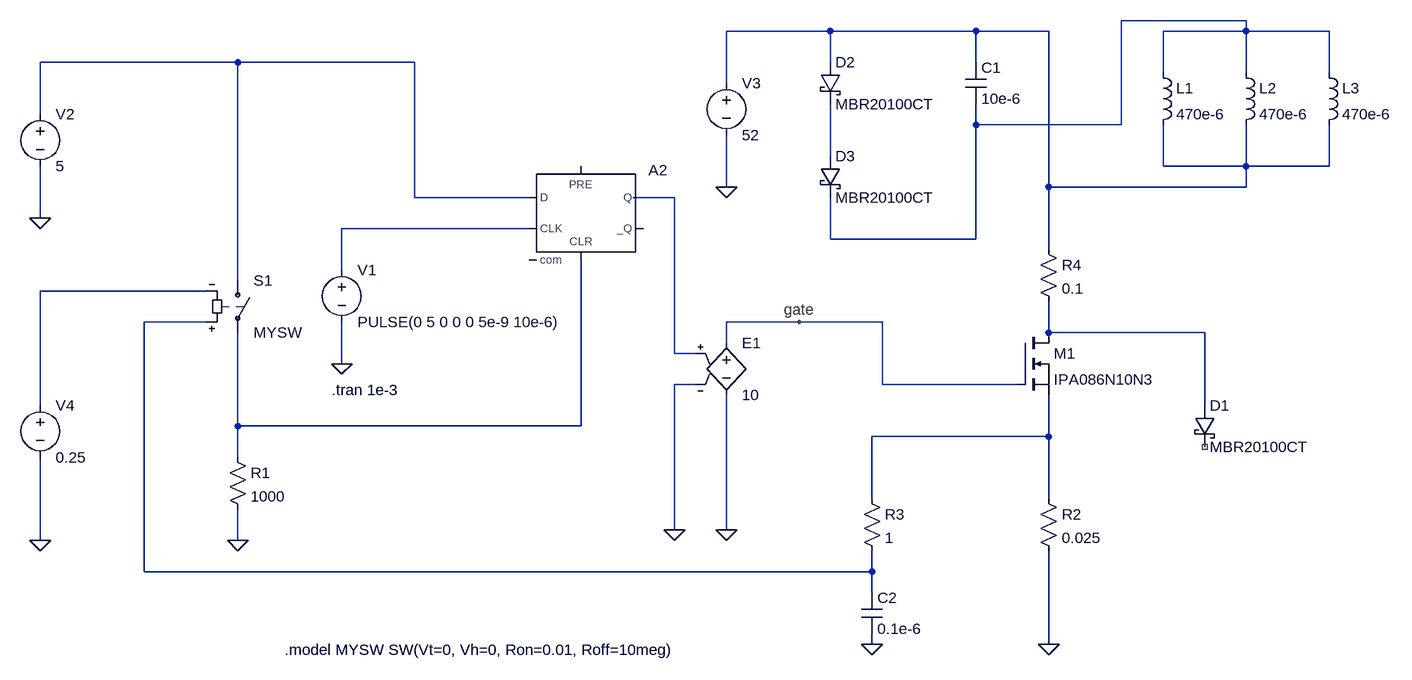
[diagram p0: schematic LT spice model hv9910c v3.asc]
LT spice model hv9910c v3.asc, the LTspice schematic file:
Version 4
SHEET 1 1160 696
WIRE 880 -288 688 -288
WIRE 240 -272 80 -272
WIRE 464 -272 240 -272
WIRE 576 -272 464 -272
WIRE 880 -272 880 -288
WIRE 880 -272 752 -272
WIRE 1008 -272 880 -272
WIRE -672 -224 -976 -224
WIRE -400 -224 -672 -224
WIRE 240 -224 240 -272
WIRE 464 -224 464 -272
WIRE 752 -208 752 -272
WIRE 880 -208 880 -272
WIRE 1008 -208 1008 -272
WIRE 80 -192 80 -272
WIRE -976 -144 -976 -224
WIRE 464 -128 464 -160
WIRE 688 -128 688 -288
WIRE 688 -128 464 -128
WIRE 240 -80 240 -160
WIRE 752 -64 752 -128
WIRE 880 -64 880 -128
WIRE 880 -64 752 -64
WIRE 1008 -64 1008 -128
WIRE 1008 -64 880 -64
WIRE 80 -32 80 -112
WIRE 576 -32 576 -272
WIRE 880 -32 880 -64
WIRE 880 -32 576 -32
WIRE -400 -16 -400 -224
WIRE -224 -16 -400 -16
WIRE 0 -16 -64 -16
WIRE -976 16 -976 -64
WIRE -224 32 -512 32
WIRE 240 48 240 -16
WIRE 464 48 464 -128
WIRE 464 48 240 48
WIRE 576 64 576 -32
WIRE -512 96 -512 32
WIRE -672 112 -672 -224
WIRE -720 128 -976 128
WIRE -720 176 -816 176
WIRE 192 176 80 176
WIRE 320 176 192 176
WIRE 576 192 576 144
WIRE 816 192 576 192
WIRE 80 208 80 176
WIRE 0 224 0 -16
WIRE 32 224 0 224
WIRE -512 240 -512 176
WIRE 32 272 0 272
WIRE 320 272 320 176
WIRE 528 272 320 272
WIRE -976 304 -976 128
WIRE 816 304 816 192
WIRE -672 336 -672 192
WIRE -144 336 -144 80
WIRE -144 336 -672 336
WIRE 576 352 576 288
WIRE 576 352 304 352
WIRE -672 384 -672 336
WIRE 304 448 304 352
WIRE 576 448 576 352
WIRE 0 496 0 272
WIRE 80 496 80 288
WIRE -976 512 -976 384
WIRE -672 512 -672 464
WIRE -816 560 -816 176
WIRE 304 560 304 528
WIRE 304 560 -816 560
WIRE 304 592 304 560
WIRE 304 672 304 656
WIRE 576 672 576 528
FLAG -512 240 0
FLAG -976 16 0
FLAG -672 512 0
FLAG 576 672 0
FLAG 80 -32 0
FLAG -976 512 0
FLAG 80 496 0
FLAG 0 496 0
FLAG 304 672 0
FLAG 192 176 gate
SYMBOL voltage -512 80 R0
WINDOW 123 0 0 Left 0
WINDOW 39 0 0 Left 0
SYMATTR InstName V1
SYMATTR Value PULSE(0 5 0 0 0 5e-9 10e-6)
SYMBOL voltage -976 -160 R0
WINDOW 123 0 0 Left 0
WINDOW 39 0 0 Left 0
SYMATTR InstName V2
SYMATTR Value 5
SYMBOL sw -672 96 R0
SYMATTR InstName S1
SYMATTR Value MYSW
SYMBOL res -688 368 R0
SYMATTR InstName R1
SYMATTR Value 1000
SYMBOL nmos 528 192 R0
SYMATTR InstName M1
SYMATTR Value IPA086N10N3
SYMBOL res 560 432 R0
SYMATTR InstName R2
SYMATTR Value 0.025
SYMBOL schottky 800 304 R0
SYMATTR InstName D1
SYMATTR Value MBR20100CT
SYMATTR Description Diode
SYMATTR Type diode
SYMBOL voltage 80 -208 R0
WINDOW 123 0 0 Left 0
WINDOW 39 0 0 Left 0
SYMATTR InstName V3
SYMATTR Value 52
SYMBOL cap 448 -224 R0
SYMATTR InstName C1
SYMATTR Value 10e-6
SYMBOL schottky 224 -224 R0
SYMATTR InstName D2
SYMATTR Value MBR20100CT
SYMATTR Description Diode
SYMATTR Type diode
SYMBOL schottky 224 -80 R0
SYMATTR InstName D3
SYMATTR Value MBR20100CT
SYMATTR Description Diode
SYMATTR Type diode
SYMBOL voltage -976 288 R0
WINDOW 123 0 0 Left 0
WINDOW 39 0 0 Left 0
SYMATTR InstName V4
SYMATTR Value 0.25
SYMBOL e 80 192 R0
SYMATTR InstName E1
SYMATTR Value 10
SYMBOL Digital\\dflop -144 -64 R0
SYMATTR InstName A2
SYMBOL cap 288 592 R0
SYMATTR InstName C2
SYMATTR Value 0.1e-6
SYMBOL res 288 432 R0
SYMATTR InstName R3
SYMATTR Value 1
SYMBOL res 560 48 R0
SYMATTR InstName R4
SYMATTR Value 0.1
SYMBOL ind 736 -224 R0
SYMATTR InstName L1
SYMATTR Value 470e-6
SYMBOL ind 864 -224 R0
SYMATTR InstName L2
SYMATTR Value 470e-6
SYMBOL ind 992 -224 R0
SYMATTR InstName L3
SYMATTR Value 470e-6
TEXT -528 280 Left 2 !.tran 1e-3
TEXT -600 680 Left 2 !.model MYSW SW(Vt=0, Vh=0, Ron=0.01, Roff=10meg)

The netlist it stands for:
* LT spice model hv9910c v3.asc
V1 N006 0 PULSE(0 5 0 0 0 5e-9 10e-6)
V2 N003 0 5
S1 N003 N010 N008 N007 MYSW
R1 N010 0 1000
M1 N009 gate N011 N011 IPA086N10N3
R2 N011 0 0.025
D1 N009 NC_01 MBR20100CT
V3 N002 0 52
C1 N002 N001 10e-6
D2 N002 N004 MBR20100CT
D3 N004 N001 MBR20100CT
V4 N007 0 0.25
E1 gate 0 N005 0 10
A2 N003 0 N006 0 N010 0 N005 0 DFLOP
C2 N008 0 0.1e-6
R3 N011 N008 1
R4 N002 N009 0.1
L1 N001 N002 470e-6
L2 N001 N002 470e-6
L3 N001 N002 470e-6
.model D D
.lib standard.dio
.model NMOS NMOS
.model PMOS PMOS
.lib standard.mos
.tran 1e-3
.model MYSW SW(Vt=0, Vh=0, Ron=0.01, Roff=10meg)
.backanno
.end